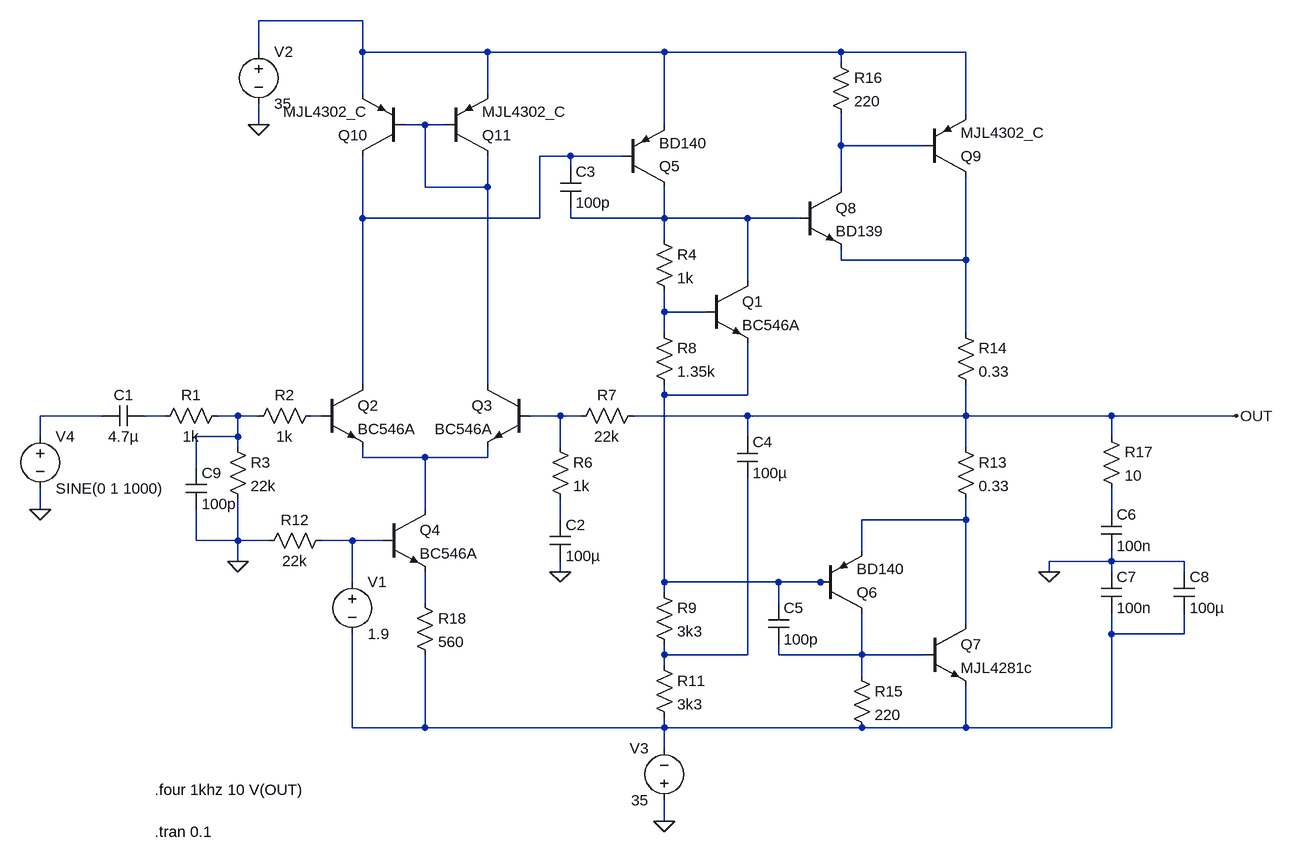
[diagram p0: schematic P3A.asc]
P3A.asc, the LTspice schematic file:
Version 4
SHEET 1 1908 884
WIRE 496 -464 336 -464
WIRE 336 -416 336 -464
WIRE 496 -416 496 -464
WIRE 688 -416 496 -416
WIRE 960 -416 688 -416
WIRE 1232 -416 960 -416
WIRE 1424 -416 1232 -416
WIRE 1232 -400 1232 -416
WIRE 496 -352 496 -416
WIRE 688 -352 688 -416
WIRE 1424 -320 1424 -416
WIRE 336 -304 336 -336
WIRE 592 -304 560 -304
WIRE 624 -304 592 -304
WIRE 960 -304 960 -416
WIRE 1232 -272 1232 -320
WIRE 1360 -272 1232 -272
WIRE 816 -256 768 -256
WIRE 896 -256 816 -256
WIRE 816 -240 816 -256
WIRE 592 -208 592 -304
WIRE 688 -208 688 -256
WIRE 688 -208 592 -208
WIRE 1232 -208 1232 -272
WIRE 496 -160 496 -256
WIRE 768 -160 768 -256
WIRE 768 -160 496 -160
WIRE 816 -160 816 -176
WIRE 960 -160 960 -208
WIRE 960 -160 816 -160
WIRE 1088 -160 960 -160
WIRE 1168 -160 1088 -160
WIRE 960 -128 960 -160
WIRE 1232 -96 1232 -112
WIRE 1424 -96 1424 -224
WIRE 1424 -96 1232 -96
WIRE 1088 -64 1088 -160
WIRE 960 -16 960 -48
WIRE 1024 -16 960 -16
WIRE 960 16 960 -16
WIRE 1424 16 1424 -96
WIRE 496 96 496 -160
WIRE 688 96 688 -208
WIRE 960 112 960 96
WIRE 1088 112 1088 32
WIRE 1088 112 960 112
WIRE 96 144 0 144
WIRE 192 144 160 144
WIRE 304 144 272 144
WIRE 336 144 304 144
WIRE 432 144 416 144
WIRE 800 144 752 144
WIRE 832 144 800 144
WIRE 1088 144 912 144
WIRE 1424 144 1424 96
WIRE 1424 144 1088 144
WIRE 1648 144 1424 144
WIRE 1840 144 1648 144
WIRE 0 176 0 144
WIRE 304 176 304 144
WIRE 304 176 240 176
WIRE 1088 176 1088 144
WIRE 1648 176 1648 144
WIRE 304 192 304 176
WIRE 800 192 800 144
WIRE 1424 192 1424 144
WIRE 496 208 496 192
WIRE 592 208 496 208
WIRE 688 208 688 192
WIRE 688 208 592 208
WIRE 240 224 240 176
WIRE 0 288 0 256
WIRE 592 288 592 208
WIRE 1648 288 1648 256
WIRE 800 304 800 272
WIRE 1424 304 1424 272
WIRE 1424 304 1264 304
WIRE 240 336 240 288
WIRE 304 336 304 272
WIRE 304 336 240 336
WIRE 352 336 304 336
WIRE 480 336 432 336
WIRE 528 336 480 336
WIRE 1264 352 1264 304
WIRE 304 368 304 336
WIRE 1648 368 1648 352
WIRE 1648 368 1552 368
WIRE 1760 368 1648 368
WIRE 800 384 800 368
WIRE 1552 384 1552 368
WIRE 1648 384 1648 368
WIRE 1760 384 1760 368
WIRE 480 400 480 336
WIRE 960 400 960 112
WIRE 1136 400 960 400
WIRE 1200 400 1136 400
WIRE 1216 400 1200 400
WIRE 960 416 960 400
WIRE 592 432 592 384
WIRE 1136 432 1136 400
WIRE 1424 464 1424 304
WIRE 1648 480 1648 448
WIRE 1760 480 1760 448
WIRE 1760 480 1648 480
WIRE 960 512 960 496
WIRE 1088 512 1088 240
WIRE 1088 512 960 512
WIRE 1136 512 1136 496
WIRE 1264 512 1264 448
WIRE 1264 512 1136 512
WIRE 1360 512 1264 512
WIRE 960 528 960 512
WIRE 1264 544 1264 512
WIRE 480 624 480 480
WIRE 592 624 592 512
WIRE 592 624 480 624
WIRE 960 624 960 608
WIRE 960 624 592 624
WIRE 1264 624 960 624
WIRE 1424 624 1424 560
WIRE 1424 624 1264 624
WIRE 1648 624 1648 480
WIRE 1648 624 1424 624
WIRE 960 656 960 624
WIRE 960 768 960 736
FLAG 304 368 0
FLAG 800 384 0
FLAG 1840 144 OUT
FLAG 1552 384 0
FLAG 960 768 0
FLAG 336 -304 0
FLAG 0 288 0
SYMBOL cap 160 128 R90
WINDOW 0 0 32 VBottom 2
WINDOW 3 32 32 VTop 2
SYMATTR InstName C1
SYMATTR Value 4.7µ
SYMBOL res 288 128 R90
WINDOW 0 0 56 VBottom 2
WINDOW 3 32 56 VTop 2
SYMATTR InstName R1
SYMATTR Value 1k
SYMBOL res 432 128 R90
WINDOW 0 0 56 VBottom 2
WINDOW 3 32 56 VTop 2
SYMATTR InstName R2
SYMATTR Value 1k
SYMBOL res 288 176 R0
SYMATTR InstName R3
SYMATTR Value 22k
SYMBOL npn 432 96 R0
SYMATTR InstName Q2
SYMATTR Value BC546A
SYMBOL npn 752 96 M0
SYMATTR InstName Q3
SYMATTR Value BC546A
SYMBOL res 784 176 R0
SYMATTR InstName R6
SYMATTR Value 1k
SYMBOL res 928 128 R90
WINDOW 0 0 56 VBottom 2
WINDOW 3 32 56 VTop 2
SYMATTR InstName R7
SYMATTR Value 22k
SYMBOL cap 784 304 R0
SYMATTR InstName C2
SYMATTR Value 100µ
SYMBOL pnp 896 -208 M180
SYMATTR InstName Q5
SYMATTR Value BD140
SYMBOL cap 800 -240 R0
SYMATTR InstName C3
SYMATTR Value 100p
SYMBOL cap 1072 176 R0
SYMATTR InstName C4
SYMATTR Value 100µ
SYMBOL pnp 1200 448 M180
SYMATTR InstName Q6
SYMATTR Value BD140
SYMBOL cap 1120 432 R0
SYMATTR InstName C5
SYMATTR Value 100p
SYMBOL res 1408 176 R0
SYMATTR InstName R13
SYMATTR Value 0.33
SYMBOL res 1408 0 R0
SYMATTR InstName R14
SYMATTR Value 0.33
SYMBOL res 1248 528 R0
SYMATTR InstName R15
SYMATTR Value 220
SYMBOL npn 1360 464 R0
SYMATTR InstName Q7
SYMATTR Value MJL4281c
SYMBOL npn 1168 -208 R0
SYMATTR InstName Q8
SYMATTR Value BD139
SYMBOL res 1216 -416 R0
SYMATTR InstName R16
SYMATTR Value 220
SYMBOL pnp 1360 -224 M180
SYMATTR InstName Q9
SYMATTR Value MJL4302_C
SYMBOL res 1632 160 R0
SYMATTR InstName R17
SYMATTR Value 10
SYMBOL cap 1632 288 R0
SYMATTR InstName C6
SYMATTR Value 100n
SYMBOL cap 1632 384 R0
SYMATTR InstName C7
SYMATTR Value 100n
SYMBOL cap 1744 384 R0
SYMATTR InstName C8
SYMATTR Value 100µ
SYMBOL voltage 336 -432 R0
WINDOW 123 0 0 Left 0
WINDOW 39 0 0 Left 0
SYMATTR InstName V2
SYMATTR Value 35
SYMBOL voltage 960 752 R180
WINDOW 0 24 96 Left 2
WINDOW 3 24 16 Left 2
WINDOW 123 0 0 Left 0
WINDOW 39 0 0 Left 0
SYMATTR InstName V3
SYMATTR Value 35
SYMBOL voltage 0 160 R0
WINDOW 123 0 0 Left 0
WINDOW 39 0 0 Left 0
SYMATTR InstName V4
SYMATTR Value SINE(0 1 1000)
SYMBOL res 944 -144 R0
SYMATTR InstName R4
SYMATTR Value 1k
SYMBOL res 944 0 R0
SYMATTR InstName R8
SYMATTR Value 1.35k
SYMBOL npn 1024 -64 R0
SYMATTR InstName Q1
SYMATTR Value BC546A
SYMBOL res 944 400 R0
SYMATTR InstName R9
SYMATTR Value 3k3
SYMBOL res 944 512 R0
SYMATTR InstName R11
SYMATTR Value 3k3
SYMBOL npn 528 288 R0
SYMATTR InstName Q4
SYMATTR Value BC546A
SYMBOL res 448 320 R90
WINDOW 0 0 56 VBottom 2
WINDOW 3 32 56 VTop 2
SYMATTR InstName R12
SYMATTR Value 22k
SYMBOL voltage 480 384 R0
WINDOW 123 0 0 Left 0
WINDOW 39 0 0 Left 0
SYMATTR InstName V1
SYMATTR Value 1.9
SYMBOL res 576 416 R0
SYMATTR InstName R18
SYMATTR Value 560
SYMBOL cap 224 224 R0
SYMATTR InstName C9
SYMATTR Value 100p
SYMBOL pnp 560 -256 R180
SYMATTR InstName Q10
SYMATTR Value MJL4302_C
SYMBOL pnp 624 -256 M180
SYMATTR InstName Q11
SYMATTR Value MJL4302_C
TEXT 176 784 Left 2 !.tran 0.1
TEXT 176 720 Left 2 !.four 1khz 10 V(OUT)

The netlist it stands for:
* P3A.asc
C1 N010 N009 4.7µ
R1 N011 N010 1k
R2 N012 N011 1k
R3 N011 0 22k
Q2 N004 N012 N014 0 BC546A
Q3 N002 N013 N014 0 BC546A
R6 N013 N016 1k
R7 OUT N013 22k
C2 N016 0 100µ
Q5 N005 N004 N001 0 BD140
C3 N004 N005 100p
C4 OUT N021 100µ
Q6 N022 N008 N017 0 BD140
C5 N008 N022 100p
R13 OUT N017 0.33
R14 N006 OUT 0.33
R15 N022 N020 220
Q7 N017 N022 N020 0 MJL4281c
Q8 N003 N005 N006 0 BD139
R16 N001 N003 220
Q9 N006 N003 N001 0 MJL4302_C
R17 OUT N015 10
C6 N015 0 100n
C7 0 N020 100n
C8 0 N020 100µ
V2 N001 0 35
V3 0 N020 35
V4 N009 0 SINE(0 1 1000)
R4 N005 N007 1k
R8 N007 N008 1.35k
Q1 N005 N007 N008 0 BC546A
R9 N008 N021 3k3
R11 N021 N020 3k3
Q4 N014 N018 N019 0 BC546A
R12 N018 0 22k
V1 N018 N020 1.9
R18 N019 N020 560
C9 N011 0 100p
Q10 N004 N002 N001 0 MJL4302_C
Q11 N002 N002 N001 0 MJL4302_C
.model NPN NPN
.model PNP PNP
.lib standard.bjt
.tran 0.1
.four 1khz 10 V(OUT)
.backanno
.end